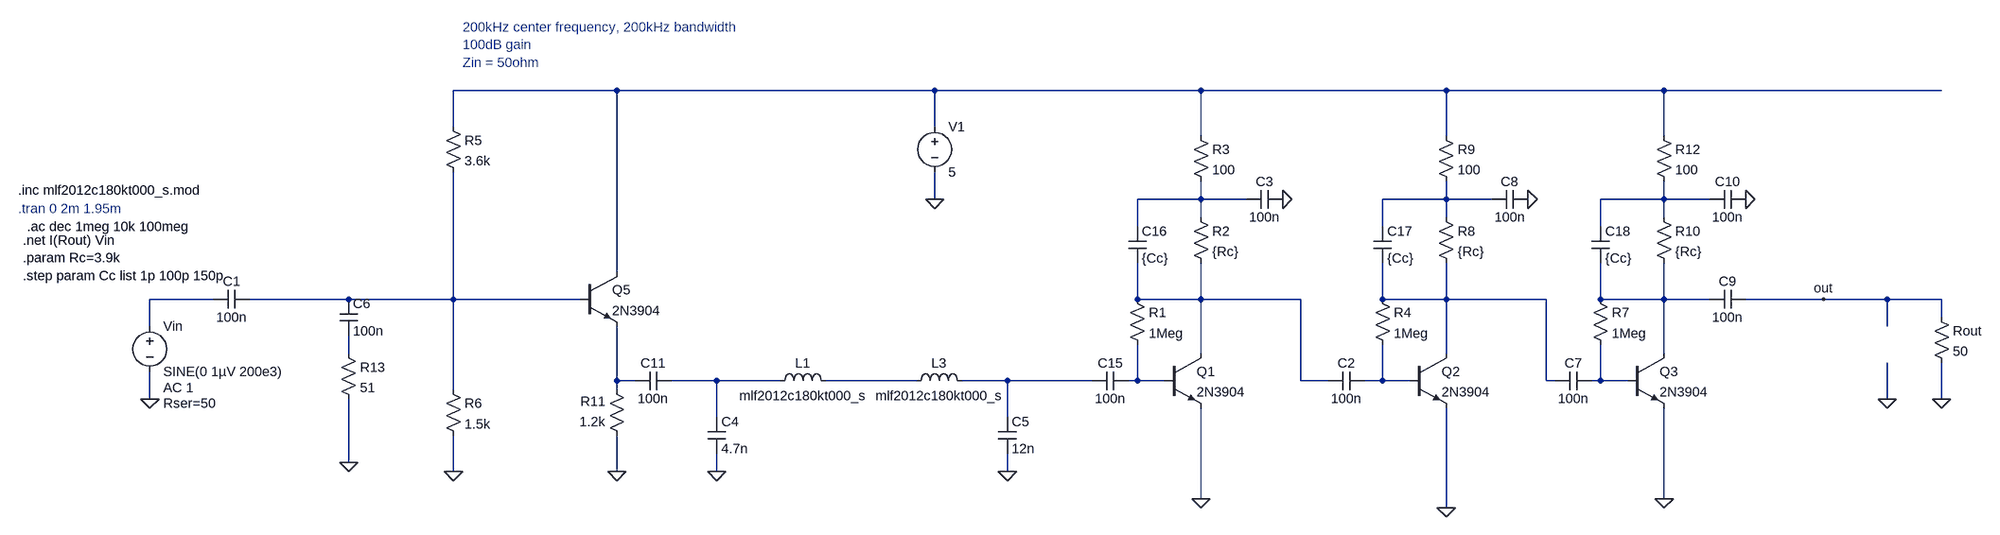
[diagram p0: schematic Yates_2010.asc]
Yates_2010.asc, the LTspice schematic file:
Version 4
SHEET 1 3120 680
WIRE -848 -400 -1136 -400
WIRE -288 -400 -848 -400
WIRE 608 -400 -288 -400
WIRE 1040 -400 608 -400
WIRE 1424 -400 1040 -400
WIRE 2048 -400 1424 -400
WIRE -1136 -336 -1136 -400
WIRE -288 -336 -288 -400
WIRE 608 -320 608 -400
WIRE 1040 -320 1040 -400
WIRE 1424 -320 1424 -400
WIRE -288 -208 -288 -256
WIRE 608 -208 608 -240
WIRE 608 -208 496 -208
WIRE 688 -208 608 -208
WIRE 1040 -208 1040 -240
WIRE 1040 -208 928 -208
WIRE 1120 -208 1040 -208
WIRE 1424 -208 1424 -240
WIRE 1424 -208 1312 -208
WIRE 1504 -208 1424 -208
WIRE 608 -176 608 -208
WIRE 1040 -176 1040 -208
WIRE 1424 -176 1424 -208
WIRE 496 -160 496 -208
WIRE 928 -160 928 -208
WIRE 1312 -160 1312 -208
WIRE -848 -80 -848 -400
WIRE -1664 -32 -1776 -32
WIRE -1344 -32 -1600 -32
WIRE -1136 -32 -1136 -256
WIRE -1136 -32 -1344 -32
WIRE -912 -32 -1136 -32
WIRE 496 -32 496 -96
WIRE 608 -32 608 -96
WIRE 608 -32 496 -32
WIRE 784 -32 608 -32
WIRE 928 -32 928 -96
WIRE 1040 -32 1040 -96
WIRE 1040 -32 928 -32
WIRE 1216 -32 1040 -32
WIRE 1312 -32 1312 -96
WIRE 1424 -32 1424 -96
WIRE 1424 -32 1312 -32
WIRE 1504 -32 1424 -32
WIRE 1840 -32 1568 -32
WIRE 1952 -32 1840 -32
WIRE 2048 -32 1952 -32
WIRE 2048 0 2048 -32
WIRE -1776 16 -1776 -32
WIRE 1952 16 1952 -32
WIRE -1344 64 -1344 32
WIRE 608 64 608 -32
WIRE 1040 64 1040 -32
WIRE 1424 64 1424 -32
WIRE -848 112 -848 16
WIRE -816 112 -848 112
WIRE -672 112 -752 112
WIRE -560 112 -672 112
WIRE -320 112 -480 112
WIRE -160 112 -240 112
WIRE 416 112 -160 112
WIRE 496 112 496 48
WIRE 496 112 480 112
WIRE 544 112 496 112
WIRE 784 112 784 -32
WIRE 832 112 784 112
WIRE 928 112 928 48
WIRE 928 112 896 112
WIRE 976 112 928 112
WIRE 1216 112 1216 -32
WIRE 1232 112 1216 112
WIRE 1312 112 1312 48
WIRE 1312 112 1296 112
WIRE 1360 112 1312 112
WIRE -1136 128 -1136 -32
WIRE -848 128 -848 112
WIRE -1776 144 -1776 96
WIRE 1952 144 1952 80
WIRE 2048 144 2048 80
WIRE -672 176 -672 112
WIRE -160 176 -160 112
WIRE -1344 256 -1344 144
WIRE -1136 272 -1136 208
WIRE -848 272 -848 208
WIRE -672 272 -672 240
WIRE -160 272 -160 240
WIRE 608 320 608 160
WIRE 1424 320 1424 160
WIRE 1040 336 1040 160
FLAG -288 -208 0
FLAG 608 320 0
FLAG -1776 144 0
FLAG 752 -208 0
FLAG 1040 336 0
FLAG 1184 -208 0
FLAG 1424 320 0
FLAG 1568 -208 0
FLAG -672 272 0
FLAG -160 272 0
FLAG -1136 272 0
FLAG -848 272 0
FLAG -1344 256 0
FLAG 1840 -32 out
FLAG 2048 144 0
FLAG 1952 144 0
DATAFLAG -992 -32 ""
DATAFLAG -848 48 ""
DATAFLAG 528 112 ""
DATAFLAG 688 -32 ""
DATAFLAG 512 -208 ""
SYMBOL npn 544 64 R0
SYMATTR InstName Q1
SYMATTR Value 2N3904
SYMBOL res 480 -48 R0
SYMATTR InstName R1
SYMATTR Value 1Meg
SYMBOL res 592 -192 R0
SYMATTR InstName R2
SYMATTR Value {Rc}
SYMBOL res 592 -336 R0
SYMATTR InstName R3
SYMATTR Value 100
SYMBOL cap -1600 -48 R90
WINDOW 0 0 32 VBottom 2
WINDOW 3 32 32 VTop 2
SYMATTR InstName C1
SYMATTR Value 100n
SYMBOL cap 896 96 R90
WINDOW 0 0 32 VBottom 2
WINDOW 3 32 32 VTop 2
SYMATTR InstName C2
SYMATTR Value 100n
SYMBOL cap 752 -224 R90
WINDOW 0 0 32 VBottom 2
WINDOW 3 32 32 VTop 2
SYMATTR InstName C3
SYMATTR Value 100n
SYMBOL voltage -288 -352 R0
WINDOW 123 0 0 Left 0
WINDOW 39 0 0 Left 0
SYMATTR InstName V1
SYMATTR Value 5
SYMBOL voltage -1776 0 R0
WINDOW 123 24 124 Left 2
WINDOW 39 24 152 Left 2
SYMATTR Value2 AC 1
SYMATTR SpiceLine Rser=50
SYMATTR InstName Vin
SYMATTR Value SINE(0 1µV 200e3)
SYMBOL npn 976 64 R0
SYMATTR InstName Q2
SYMATTR Value 2N3904
SYMBOL res 1024 -336 R0
SYMATTR InstName R9
SYMATTR Value 100
SYMBOL cap 1296 96 R90
WINDOW 0 0 32 VBottom 2
WINDOW 3 32 32 VTop 2
SYMATTR InstName C7
SYMATTR Value 100n
SYMBOL cap 1184 -224 R90
WINDOW 0 0 32 VBottom 2
WINDOW 3 32 32 VTop 2
SYMATTR InstName C8
SYMATTR Value 100n
SYMBOL npn 1360 64 R0
SYMATTR InstName Q3
SYMATTR Value 2N3904
SYMBOL res 1408 -336 R0
SYMATTR InstName R12
SYMATTR Value 100
SYMBOL cap 1568 -48 R90
WINDOW 0 0 32 VBottom 2
WINDOW 3 32 32 VTop 2
SYMATTR InstName C9
SYMATTR Value 100n
SYMBOL cap 1568 -224 R90
WINDOW 0 0 32 VBottom 2
WINDOW 3 32 32 VTop 2
SYMATTR InstName C10
SYMATTR Value 100n
SYMBOL res 912 -48 R0
SYMATTR InstName R4
SYMATTR Value 1Meg
SYMBOL res 1296 -48 R0
SYMATTR InstName R7
SYMATTR Value 1Meg
SYMBOL res 1024 -192 R0
SYMATTR InstName R8
SYMATTR Value {Rc}
SYMBOL res 1408 -192 R0
SYMATTR InstName R10
SYMATTR Value {Rc}
SYMBOL cap -688 176 R0
SYMATTR InstName C4
SYMATTR Value 4.7n
SYMBOL cap -176 176 R0
SYMATTR InstName C5
SYMATTR Value 12n
SYMBOL ind -576 128 R270
WINDOW 0 32 56 VTop 2
WINDOW 3 5 56 VBottom 2
SYMATTR InstName L1
SYMATTR Value mlf2012c180kt000_s
SYMATTR Prefix X
SYMBOL ind -336 128 R270
WINDOW 0 32 56 VTop 2
WINDOW 3 5 56 VBottom 2
SYMATTR InstName L3
SYMATTR Value mlf2012c180kt000_s
SYMATTR Prefix X
SYMBOL npn -912 -80 R0
SYMATTR InstName Q5
SYMATTR Value 2N3904
SYMBOL res -1152 -352 R0
SYMATTR InstName R5
SYMATTR Value 3.6k
SYMBOL res -1152 112 R0
SYMATTR InstName R6
SYMATTR Value 1.5k
SYMBOL res -832 224 R180
WINDOW 0 36 76 Left 2
WINDOW 3 36 40 Left 2
SYMATTR InstName R11
SYMATTR Value 1.2k
SYMBOL cap -1360 -32 R0
SYMATTR InstName C6
SYMATTR Value 100n
SYMBOL res -1360 48 R0
SYMATTR InstName R13
SYMATTR Value 51
SYMBOL cap -752 96 R90
WINDOW 0 0 32 VBottom 2
WINDOW 3 32 32 VTop 2
SYMATTR InstName C11
SYMATTR Value 100n
SYMBOL res 2032 -16 R0
SYMATTR InstName Rout
SYMATTR Value 50
SYMBOL cap 480 96 R90
WINDOW 0 0 32 VBottom 2
WINDOW 3 32 32 VTop 2
SYMATTR InstName C15
SYMATTR Value 100n
SYMBOL cap 480 -160 R0
SYMATTR InstName C16
SYMATTR Value {Cc}
SYMBOL cap 912 -160 R0
SYMATTR InstName C17
SYMATTR Value {Cc}
SYMBOL cap 1296 -160 R0
SYMATTR InstName C18
SYMATTR Value {Cc}
TEXT -1992 -160 Left 2 !.ac dec 1meg 10k 100meg
TEXT -2008 -192 Left 2 ;.tran 0 2m 1.95m
TEXT -2000 -136 Left 2 !.net I(Rout) Vin\n.param Rc=3.9k\n.step param Cc list 1p 100p 150p
TEXT -2008 -224 Left 2 !.inc mlf2012c180kt000_s.mod
TEXT -1120 -512 Left 2 ;200kHz center frequency, 200kHz bandwidth\n100dB gain\nZin = 50ohm

The netlist it stands for:
* Yates_2010.asc
Q1 N007 N015 0 0 2N3904
R1 N007 N015 1Meg
R2 N002 N007 {Rc}
R3 N001 N002 100
C1 N006 N005 100n
C2 N016 N007 100n
C3 0 N002 100n
V1 N001 0 5
Vin N005 0 SINE(0 1µV 200e3) AC 1 Rser=50
Q2 N008 N016 0 0 2N3904
R9 N001 N003 100
C7 N017 N008 100n
C8 0 N003 100n
Q3 N009 N017 0 0 2N3904
R12 N001 N004 100
C9 out N009 100n
C10 0 N004 100n
R4 N008 N016 1Meg
R7 N009 N017 1Meg
R8 N003 N008 {Rc}
R10 N004 N009 {Rc}
C4 N012 0 4.7n
C5 N014 0 12n
XL1 N012 N013 mlf2012c180kt000_s  ; pins A B
XL3 N013 N014 mlf2012c180kt000_s  ; pins A B
Q5 N001 N006 N011 0 2N3904
R5 N001 N006 3.6k
R6 N006 0 1.5k
R11 0 N011 1.2k
C6 N006 N010 100n
R13 N010 0 51
C11 N012 N011 100n
Rout out 0 50
C15 N015 N014 100n
C16 N002 N007 {Cc}
C17 N003 N008 {Cc}
C18 N004 N009 {Cc}
.model NPN NPN
.model PNP PNP
.lib standard.bjt
.ac dec 1meg 10k 100meg
* .tran 0 2m 1.95m
.net I(Rout) Vin
.param Rc=3.9k
.step param Cc list 1p 100p 150p
.inc mlf2012c180kt000_s.mod
* 200kHz center frequency, 200kHz bandwidth
* 100dB gain
* Zin = 50ohm
.backanno
.end